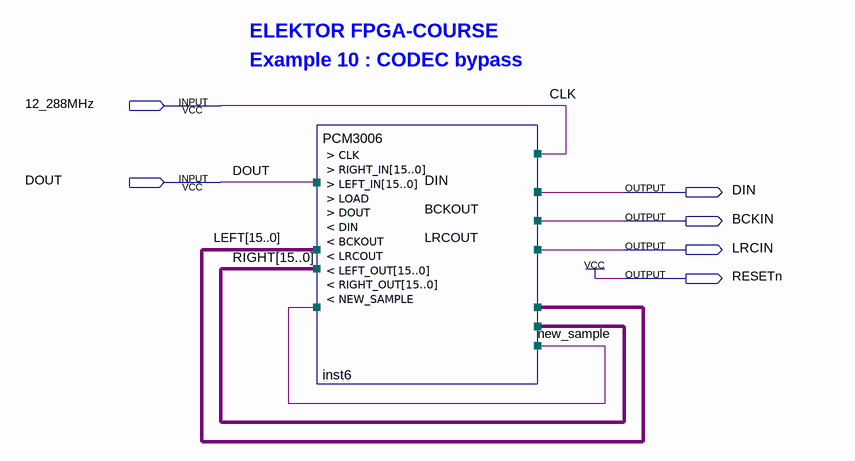
[diagram p0: schematic sheet]
// Quartus schematic ex10.bdf as structural Verilog: 1 symbols, 6 pins
module ex10 (
  input  \12_288MHz ,
  input  DOUT,
  output DIN,
  output BCKIN,
  output LRCIN,
  output RESETn
);

  wire new_sample;
  wire [15:0] LEFT, RIGHT;

  PCM3006 inst6 (
    .CLK(\12_288MHz ), .RIGHT_IN(LEFT), .LEFT_IN(RIGHT), .LOAD(new_sample), .DOUT(DOUT), .DIN(DIN),
    .BCKOUT(BCKIN), .LRCOUT(LRCIN), .LEFT_OUT(LEFT), .RIGHT_OUT(RIGHT), .NEW_SAMPLE(new_sample));

  assign RESETn = 1'b1;

  // Other names for the same wires on the sheet: BCKOUT = BCKIN; CLK = \12_288MHz ; LRCOUT = LRCIN

  // Notes on the sheet:
  //   ELEKTOR FPGA-COURSE
  //   Example 10 : CODEC bypass
endmodule
